# EAGLE design T65MagicPhone (EAGLE 8.4.1)
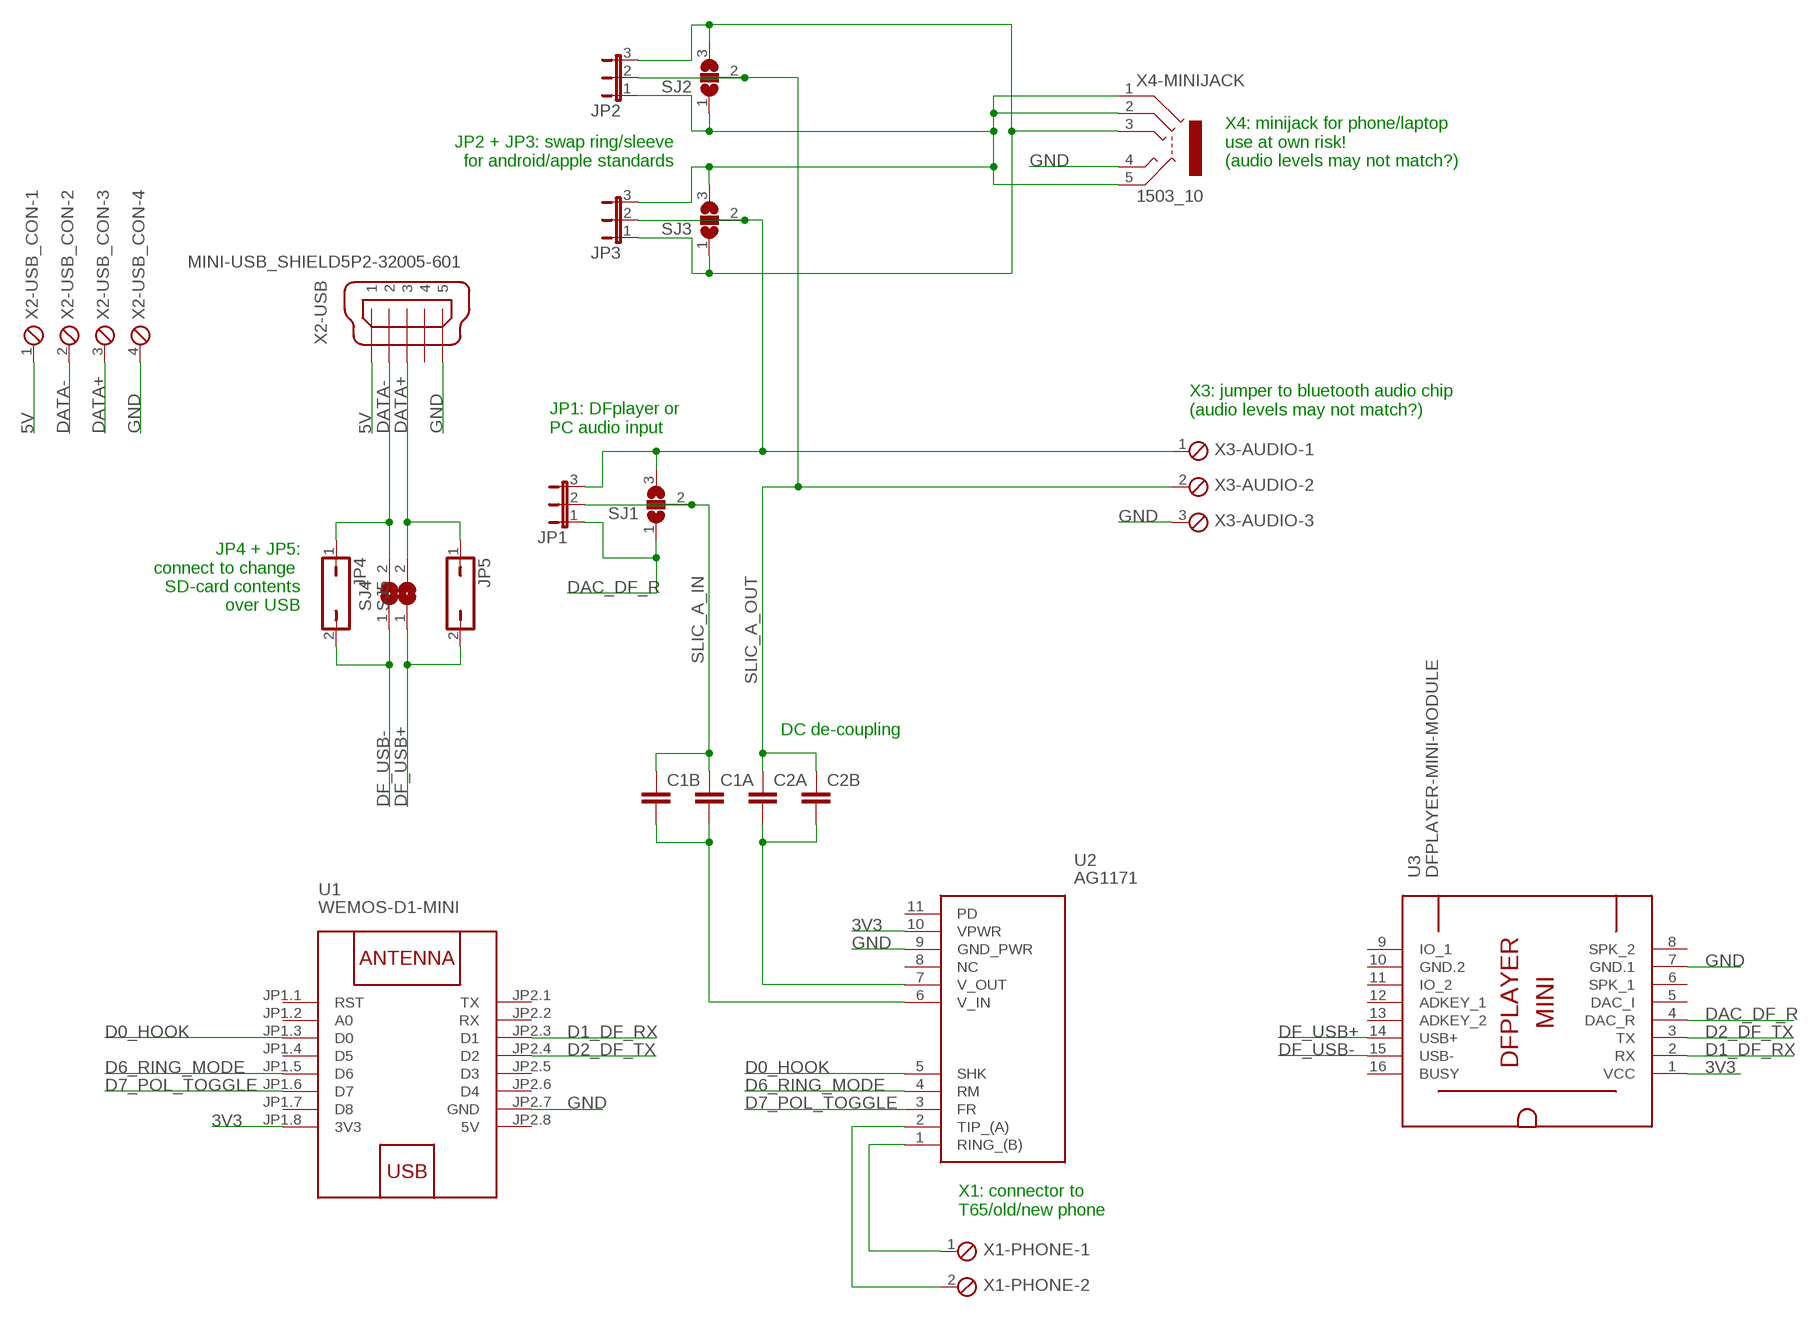
[diagram p0: schematic, sheet 1]

## Parts
C1A  C-EUC0805K  [C0805K]
C1B  C-EU025-030X050  [C025-030X050]
C2A  C-EUC0805K  [C0805K]
C2B  C-EU025-030X050  [C025-030X050]
JP1  JP2E  [JP2]
JP2  JP2E  [JP2]
JP3  JP2E  [JP2]
JP4  JP1Q  [JP1]
JP5  JP1Q  [JP1]
SJ1  SJ2W  [SJ_2]
SJ2  SJ2W  [SJ_2]
SJ3  SJ2W  [SJ_2]
SJ4  SJ  [SJ]
SJ5  SJ  [SJ]
U1  WEMOS-D1-MINI  [WEMOS-D1-MINI]
U2  AG1171  [AG1171]
U3  DFPLAYER-MINI-MODULE  [DFPLAYER-MINI-MODULE]
X1-PHONE  MPT2  [2POL254]
X2-USB  MINI-USB_SHIELD5P2-32005-601  [32005-601]
X2-USB_CON  MPT4  [4POL254]
X3-AUDIO  MPT3  [3POL254]
X4-MINIJACK  1503_10  [1503_10]

## Nets
3V3: U1.JP1.8(3V3) U2.10(VPWR) U3.1(VCC)
5V: X2-USB.1 X2-USB_CON.1
A_TIP: U2.2(TIP_(A)) X1-PHONE.2
B_RING: U2.1(RING_(B)) X1-PHONE.1
D0_HOOK: U1.JP1.3(D0) U2.5(SHK)
D1_DF_RX: U1.JP2.3(D1) U3.2(RX)
D2_DF_TX: U1.JP2.4(D2) U3.3(TX)
D6_RING_MODE: U1.JP1.5(D6) U2.4(RM)
D7_POL_TOGGLE: U1.JP1.6(D7) U2.3(FR)
DAC_DF_R: JP1.1 SJ1.1 U3.4(DAC_R)
DATA+: JP5.1 SJ5.2 X2-USB.3 X2-USB_CON.3
DATA-: JP4.1 SJ4.2 X2-USB.2 X2-USB_CON.2
DF_USB+: JP5.2 SJ5.1 U3.14(USB+)
DF_USB-: JP4.2 SJ4.1 U3.15(USB-)
GND: U1.JP2.7(GND) U2.9(GND_PWR) U3.7(GND.1) X2-USB.5 X2-USB_CON.4 X3-AUDIO.3 X4-MINIJACK.4
N$2: JP2.1 JP3.3 SJ2.1 SJ3.3 X4-MINIJACK.1 X4-MINIJACK.2 X4-MINIJACK.5
N$4: JP2.3 JP3.1 SJ2.3 SJ3.1 X4-MINIJACK.3
N$7: JP1.3 JP3.2 SJ1.3 SJ3.2 X3-AUDIO.1
SLIC_A_IN: C1A.1 C1B.1 JP1.2 SJ1.2
SLIC_A_OUT: C2A.1 C2B.1 JP2.2 SJ2.2 X3-AUDIO.2
V_IN: C1A.2 C1B.2 U2.6(V_IN)
V_OUT: C2A.2 C2B.2 U2.7(V_OUT)
Unconnected: U1.JP1.1(RST) U1.JP1.2(A0) U1.JP1.4(D5) U1.JP1.7(D8) U1.JP2.1(TX) U1.JP2.2(RX) U1.JP2.5(D3) U1.JP2.6(D4) U2.8(NC) U2.11(PD) U3.5(DAC_I) U3.6(SPK_1) U3.8(SPK_2) U3.9(IO_1) U3.11(IO_2) U3.12(ADKEY_1) U3.13(ADKEY_2) U3.16(BUSY) X2-USB.4 X2-USB.M1(S1) X2-USB.M2(S2)

## Notes on the sheet
- JP2 + JP3: swap ring/sleeve
  for android/apple standards
- X4: minijack for phone/laptop
  use at own risk!
  (audio levels may not match?)
- X3: jumper to bluetooth audio chip
  (audio levels may not match?)
- JP1: DFplayer or 
  PC audio input
- JP4 + JP5:
  connect to change 
  SD-card contents
  over USB
- DC de-coupling
- X1: connector to 
  T65/old/new phone

## Power pins joined to a net without a drawn wire
5V: U1.JP2.8(5V)
GND.2: U3.10(GND.2)

## Library data of the parts
C1A C1B C2A C2B = rcl:C-EU: CAPACITOR, European symbol
JP1-JP3 = jumper:JP2E: JUMPER
JP4 JP5 = jumper:JP1Q: JUMPER
SJ1-SJ3 = jumper:SJ2W: SMD solder JUMPER
SJ4 SJ5 = jumper:SJ: SMD solder JUMPER
U1 = diy-modules:WEMOS-D1-MINI: WEMOS D1 mini: Mini Wi-Fi Board based on ESP-8266 device More details can be found here: https://www.wemos.cc/product/d1-mini.html Click here to find device on ebay.com <http://www.ebay.com/sch/wemos+d1+mini+nodemcu>
U2 = Ag1171:AG1171: Interface Modules Ringing SLIC, low cost, SIL Source: Datasheet <http://silvertel.com/images/datasheets/Ag1171-datasheet-Low-cost-ringing-SLIC-with-single-supply.pdf>; DESCRIPTION: Interface Modules Ringing SLIC, low cost, SIL; HEIGHT: 12mm; MANUFACTURER_NAME: Silvertel; MANUFACTURER_PART_NUMBER: Ag1171; MOUSER_PART_NUMBER: 480-AG1171; MOUSER_PRICE-STOCK: https://www.mouser.co.uk/ProductDetail/Silvertel/Ag1171/?qs=OlC7AqGiEDmC%252B%2FzX4ycIZA%3D%3D
U3 = diy-modules:DFPLAYER-MINI-MODULE: DFPlayer Mini - MP3 player module based on YX5200 chip More details available here: https://www.dfrobot.com/wiki/index.php/DFPlayer_Mini_SKU:DFR0299 Click here to find device on ebay.com <http://www.ebay.com/sch/dfplayer+mini>
X1-PHONE = con-phoenix-254:MPT2: PHOENIX CONNECTOR; OC_FARNELL: unknown; OC_NEWARK: unknown
X2-USB = con-cypressindustries:MINI-USB_SHIELD5P2-: MINI USB-B R/A DIP 5pol. Source: www.cypressindustries.com; OC_FARNELL: unknown; OC_NEWARK: unknown
X2-USB_CON = con-phoenix-254:MPT4: PHOENIX CONNECTOR; OC_FARNELL: unknown; OC_NEWARK: unknown
X3-AUDIO = con-phoenix-254:MPT3: PHOENIX CONNECTOR; OC_FARNELL: unknown; OC_NEWARK: unknown
X4-MINIJACK = con-lumberg:1503_10: Jack connectors according to JISC 6560, 3.5 mm Klinkeneinbaukupplung, 3,5 mm, 4-polig/stereo, abgewinkelte Ausführung Source: http://www.lumberg.de/Produkte/PDFs/1503_10.pdf; OC_FARNELL: 1308868; OC_NEWARK: unknown

## Board
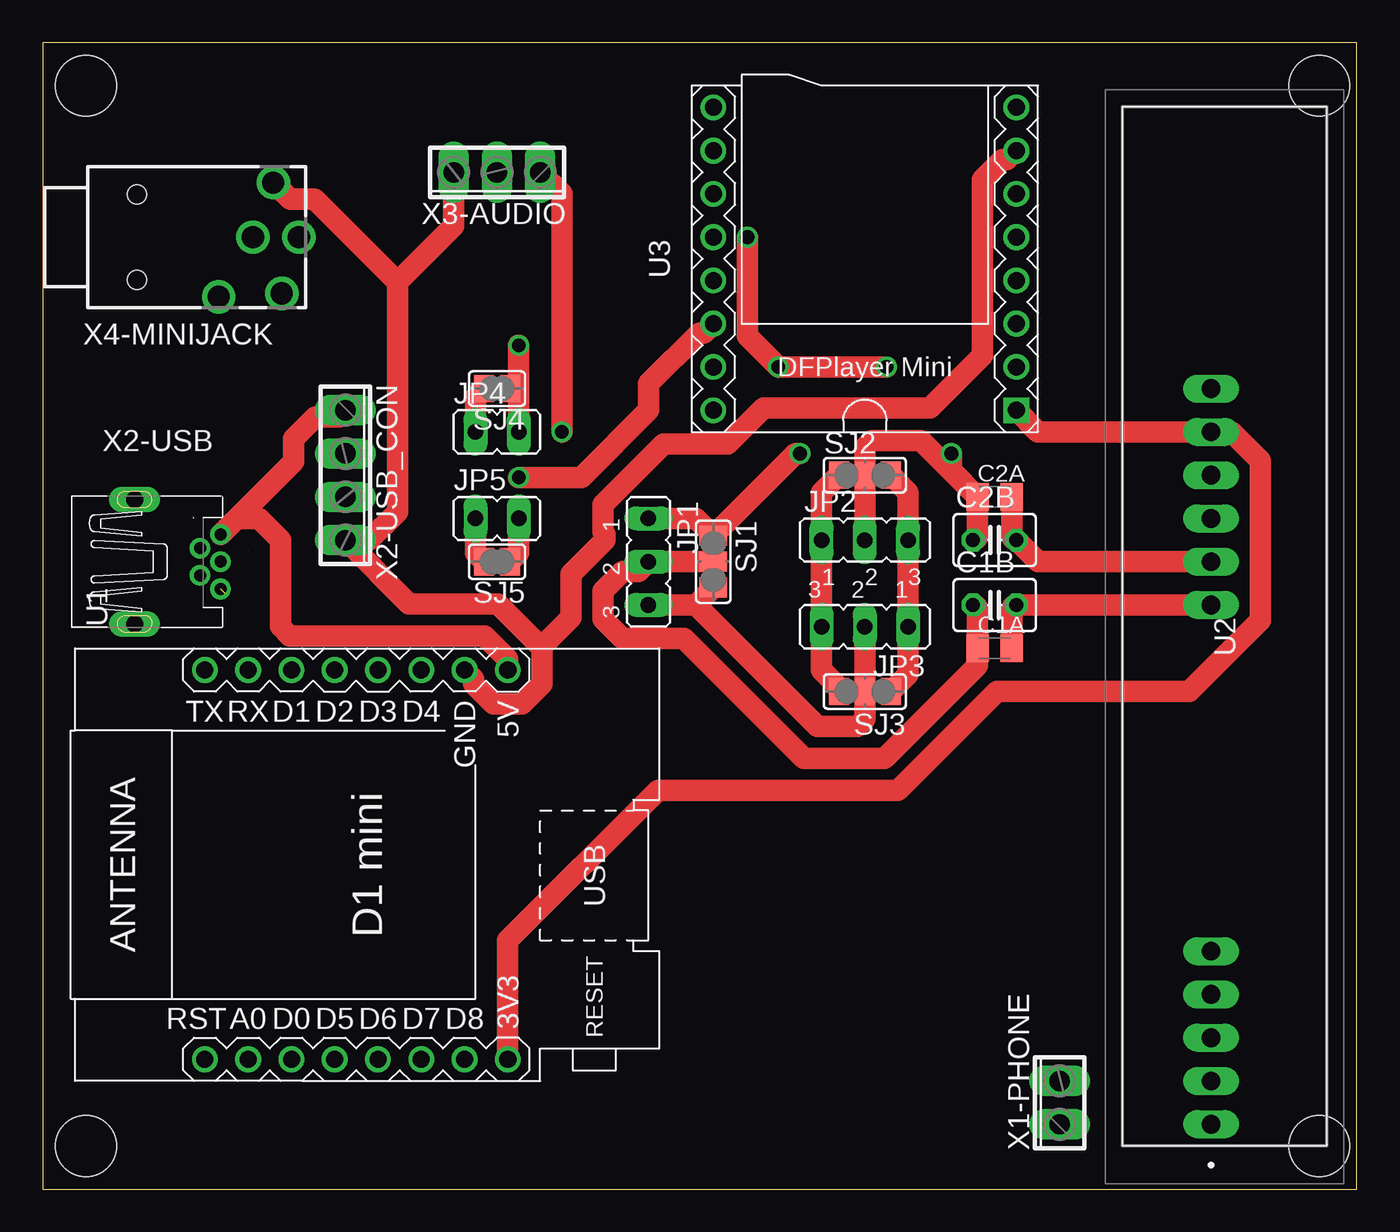
[diagram p1: board, top side]
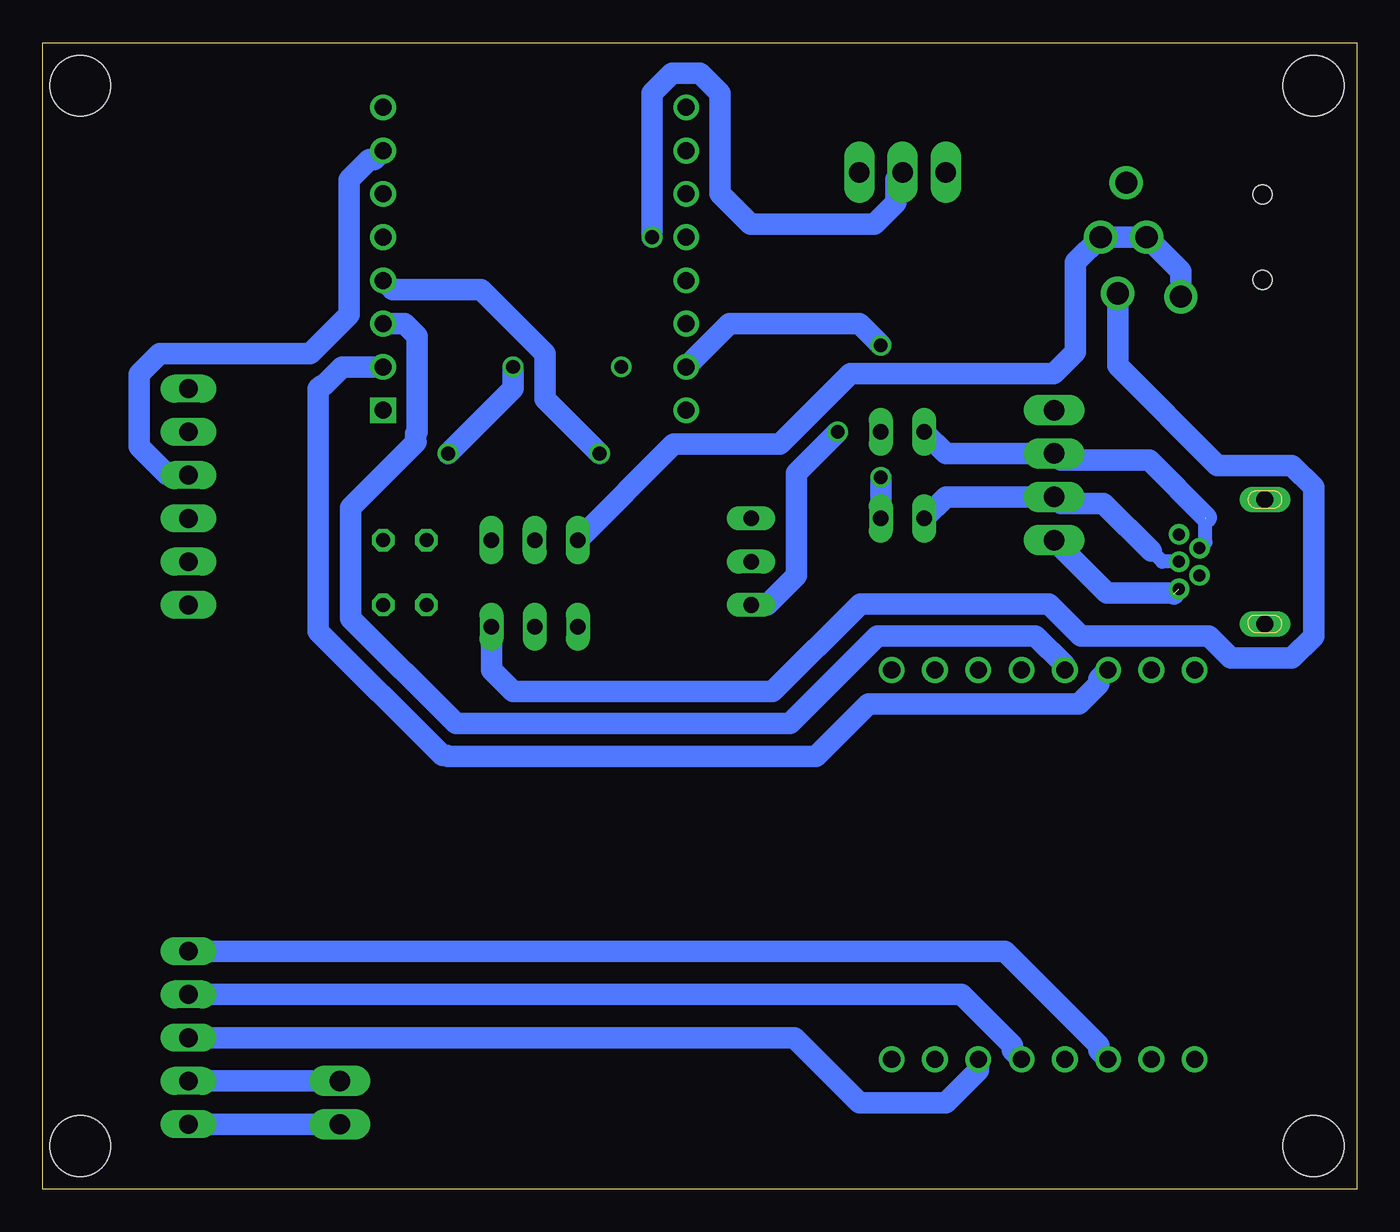
[diagram p2: board, bottom side, seen from below]

Size 77.14 x 67.3 mm. Coordinates in mm from the lower left corner, seen from the top.
Outline: 0,0 77.14,0 77.14,67.3 0,67.3 0,0
Copper layers (1*16): Top 0.035mm / dielectric 1.5mm / Bottom 0.035mm
Design rules "default *": minimum track width 6mil, minimum drill 0.35mm, track to track 24mil, track to pad 24mil, pad to pad 6mil, via to via 6mil, smd to smd 6mil, copper to edge 40mil, drill to drill 6mil, minimum pad ring 10mil, minimum via ring 8mil, stop-mask expansion 4mil, vias tented up to drill 0mil, thermal gap 10mil
Holes 3.56 mm at 74.93,64.77 74.93,2.54 2.54,2.54 2.54,64.77

### Footprints (pad centres in the part's own frame; a part is rotated, then mirrored left to right if it is on the bottom)
C0805K = smd 1.3 x 1.6: 1 -1,0; 2 1,0
C025-030X050 = drill 0.813 octagon: 1 -1.27,0; 2 1.27,0
JP2 = drill 0.914 long: 1 -2.54,0; 2 0,0; 3 2.54,0
JP1 = drill 0.914 long: 1 0,-1.27; 2 0,1.27
SJ_2 = smd 1.168 x 1.6: 1 -1.524,0; 2 0,0; 3 1.524,0
SJ = smd 1.168 x 1.6: 1 -0.762,0; 2 0.762,0
WEMOS-D1-MINI = drill 1: JP1.1 -11.43,9.525; JP1.2 -11.43,6.985; JP1.3 -11.43,4.445; JP1.4 -11.43,1.905; JP1.5 -11.43,-0.635; JP1.6 -11.43,-3.175; JP1.7 -11.43,-5.715; JP1.8 -11.43,-8.255; JP2.1 11.43,9.525; JP2.2 11.43,6.985; JP2.3 11.43,4.445; JP2.4 11.43,1.905; JP2.5 11.43,-0.635; JP2.6 11.43,-3.175; JP2.7 11.43,-5.715; JP2.8 11.43,-8.255
AG1171 = drill 1.1 pad 1.65 long: 1 0,0; 2 -2.54,0; 3 -5.08,0; 4 -7.62,0; 5 -10.16,0; 6 -30.48,0; 7 -33.02,0; 8 -35.56,0; 9 -38.1,0; 10 -40.64,0; 11 -43.18,0
DFPLAYER-MINI-MODULE = drill 1 square: 1 -8.89,-8.89 | drill 1: 2 -6.35,-8.89; 3 -3.81,-8.89; 4 -1.27,-8.89; 5 1.27,-8.89; 6 3.81,-8.89; 7 6.35,-8.89; 8 8.89,-8.89; 9 8.89,8.89; 10 6.35,8.89; 11 3.81,8.89; 12 1.27,8.89; 13 -1.27,8.89; 14 -3.81,8.89; 15 -6.35,8.89; 16 -8.89,8.89
2POL254 = drill 1.2 long: 1 -1.27,0; 2 1.27,0
32005-601 = drill 0.7 pad 1.016: 1 2.825,1.6; 2 1.625,0.8; 3 2.825,0; 4 1.625,-0.8; 5 2.825,-1.6 | drill 1 pad 1.422 long: M1 -2.225,3.65; M2 -2.225,-3.65
4POL254 = drill 1.2 long: 1 -3.81,0; 2 -1.27,0; 3 1.27,0; 4 3.81,0
3POL254 = drill 1.2 long: 1 -2.54,0; 2 0,0; 3 2.54,0
1503_10 = drill 1.3 pad 1.9: 1 -3.5,-7.8; 2 0,-9.8; 3 -3.3,-11.5; 4 3.2,-11; 5 0,-12.5 | hole 1.1: -2.5,-3; 2.5,-3

### Placement (x,y rotation side)
C1A  55.88,31.75 0 top
C1B  55.88,34.29 0 top
C2A  55.88,40.64 0 top
C2B  55.88,38.1 0 top
JP1  35.56,36.83 270 top
JP2  48.26,38.1 0 top
JP3  48.26,33.02 180 top
JP4  26.67,44.45 270 top
JP5  26.67,39.37 270 top
SJ1  39.37,36.83 270 top
SJ2  48.26,41.91 0 top
SJ3  48.26,29.21 180 top
SJ4  26.67,46.99 180 top
SJ5  26.67,36.83 180 top
U1  19.05,19.05 90 top
U2  68.58,3.81 270 top
U3  48.26,54.61 90 top
X1-PHONE  59.69,5.08 90 top
X2-USB  7.62,36.83 0 top
X2-USB_CON  17.78,41.91 270 top
X3-AUDIO  26.67,59.69 180 top
X4-MINIJACK  2.54,55.88 90 top

### Tracks (layer width: path | path; a pad name or v marks a point on that pad's centre or on a via)
3V3
  Top 1.27: U1.JP1.8 27.3,14.61 36.11,23.41 50.19,23.41 56,29.21 67.31,29.21 71.47,33.38 71.47,42.77 69.79,44.45 U2.10 58.42,44.45 U3.1
5V
  Top 1.27: X2-USB.1 11.38,39.37 | 11.38,39.37 12.7,39.37 13.97,38.1 13.97,33.02 14.51,32.48 25.94,32.48 27.3,31.11 U1.JP2.8 | X2-USB_CON.1 17.39,45.33 15.99,45.33 14.73,44.07 14.73,42.72 11.38,39.37
A_TIP
  Bottom 1.27: U2.2 X1-PHONE.2
B_RING
  Bottom 1.27: X1-PHONE.1 U2.1
D0_HOOK
  Bottom 1.27: U1.JP1.3 15.15,8.16 15.15,8.45 20.67,13.97 U2.5
D1_DF_RX
  Bottom 1.27: U3.2 59.57,48.26 60.65,47.18 60.77,47.18 60.96,46.99 60.96,32.75 53.66,25.45 53.39,25.45 53.34,25.4 31.75,25.4 28.67,28.48 16.32,28.48 15.15,29.65 15.15,29.94 U1.JP2.3
D2_DF_TX
  Bottom 1.27: 55.24,43.81 59.05,40.01 59.05,33.5 52.88,27.33 33.28,27.33 28.13,32.48 19.05,32.48 18.86,32.48 17.14,30.77 U1.JP2.4 | 55.24,43.81 55.22,43.84 | 55.24,43.81 55.24,44.36 55.15,44.45 55.15,50.07 55.88,50.8 U3.3
D6_RING_MODE
  Bottom 1.27: U1.JP1.5 20.23,8.16 20.23,8.45 23.21,11.43 U2.4
D7_POL_TOGGLE
  Bottom 1.27: U2.3 33.02,8.89 29.21,5.08 27.94,5.08 26.67,5.08 24.13,5.08 22.23,6.99 U1.JP1.6
DAC_DF_R  (via drill 0.8)
  Top 1.27: JP1.1 38.35,39.37 SJ1.1 44.2,43.18 v44.45,43.18
  Bottom 1.27: U3.4 56.61,52.8 51.41,52.8 47.65,49.04 47.65,46.38 v44.45,43.18
DATA+  (1 unrouted)
  Top 1.27: SJ5.2 25.4,37.34 JP5.1
  Bottom 0.813: 12.06,37.47 11.43,36.83 X2-USB.3
  Bottom 1.27: JP5.1 24.13,40.64 X2-USB_CON.3 17.39,40.24 14.87,40.24 12.08,37.45
DATA-  (1 unrouted)
  Top 1.27: SJ4.2 25.4,46.48 JP4.1
  Bottom 0.813: X2-USB.2 8.89,37.98 8.89,39.37
  Bottom 1.27: JP4.1 24.13,43.18 X2-USB_CON.2 17.39,42.78 12.19,42.78 8.83,39.43
DF_USB+  (via drill 0.8)
  Top 1.27: JP5.2 27.94,37.34 SJ5.1 | U3.14 38.83,50.26 38.54,50.26 35.56,47.28 35.56,45.72 31.62,41.78 v27.94,41.78
  Bottom 1.27: JP5.2 v27.94,41.78
DF_USB-  (via drill 0.8)
  Top 1.27: JP4.2 27.94,46.48 | SJ4.1 27.94,46.48 | v27.94,49.53 27.94,46.48
  Bottom 1.27: v27.94,49.53 29.21,50.8 36.83,50.8 U3.15
GND  (1 unrouted)
  Top 1.27: U3.7 56.61,60.42 56.32,60.42 55.15,59.25 55.15,48.92 52.07,45.83 42.31,45.83 40.2,43.72 36.43,43.72 32.89,40.18 32.89,38.56 33.02,38.43 33.02,38.1 31.01,36.09 31.01,33.55 29.3,31.84 29.3,31.77 | U1.JP2.7 25.31,29.94 25.31,29.65 26.48,28.48 28.13,28.48 29.3,29.65 29.3,31.77 | 29.3,31.77 26.72,34.36 21.52,34.36 X2-USB_CON.4 19.17,38.1 20.82,39.75 20.82,53.23 | X4-MINIJACK.4 14.52,58.1 15.96,58.1 20.82,53.23 | X3-AUDIO.3 24.13,56.54 20.82,53.23
  Bottom 1.27: U3.7 57.69,60.42 57.98,60.42 59.15,59.25 59.15,51.34 61.43,49.06 70.26,49.06 71.47,47.85 71.47,43.59 69.79,41.91 U2.9 | 10.75,34.92 10.81,34.98 14.66,34.98 X2-USB_CON.4
N$2
  Top 1.27: SJ3.3 46.84,29.31 46.84,29.36 45.72,30.48 JP3.3 JP2.1 45.72,40.89 SJ2.1
  Bottom 1.27: 15.24,55.88 X4-MINIJACK.5 | JP2.1 40.1,43.72 33.87,43.72 29.72,47.87 17.78,47.87 16.51,49.13 16.51,54.41 X4-MINIJACK.5 | X4-MINIJACK.5 X4-MINIJACK.2 10.34,53.88 X4-MINIJACK.1
N$4
  Top 1.27: SJ3.1 50.8,30.23 JP3.1 JP2.3 50.8,40.89 SJ2.3
  Bottom 1.27: JP3.1 50.8,30.48 49.53,29.21 34.29,29.21 29.14,34.36 18.08,34.36 16.2,32.48 8.7,32.48 7.4,31.18 3.81,31.18 2.54,32.45 2.54,41.2 3.81,42.48 8.19,42.48 14.04,48.33 X4-MINIJACK.3
N$7  (via drill 0.8)
  Top 1.27: JP3.2 SJ3.2 48.26,27.59 47.84,27.16 45.48,27.16 38.35,34.29 | SJ1.3 38.35,34.29 | 38.35,34.29 JP1.3 | X3-AUDIO.1 30.48,58.42 v30.48,44.45
  Bottom 1.27: v30.48,44.45 32.89,42.04 32.89,36.02 34.62,34.29 JP1.3
SLIC_A_IN
  Top 1.27: C1B.1 arc-90 54.88,34.02 54.88,33.02 C1A.1 54.88,30.75 49.42,25.29 44.7,25.29 37.65,32.33 34.04,32.33 32.89,33.48 32.89,35.1 34.04,36.25 34.98,36.25 JP1.2 SJ1.2
SLIC_A_OUT  (via drill 0.8)
  Top 1.27: C2B.1 arc90 54.88,38.37 C2A.1 | JP2.2 SJ2.2 48.26,43.53 48.68,43.95 51.56,43.95 C2A.1 | v49.53,48.26 v43.18,48.26 41.37,50.07 v41.37,55.88 | C2A.1 53.34,42.18 v53.34,43.18
  Bottom 1.27: v53.34,43.18 49.53,46.99 v49.53,48.26 | X3-AUDIO.2 27.07,59.3 27.07,57.9 28.32,56.65 35.6,56.65 37.37,58.42 37.37,64.33 38.54,65.5 40.2,65.5 41.37,64.33 v41.37,55.88
V_IN
  Top 1.27: C1A.2 56.88,34.02 arc-90 C1B.2 59.69,34.29 U2.6
V_OUT
  Top 1.27: C2A.2 56.88,38.37 arc90 C2B.2 58.42,36.83 U2.7